# Altium schematic sheet deepshark_power_switch.SchDoc
size A4
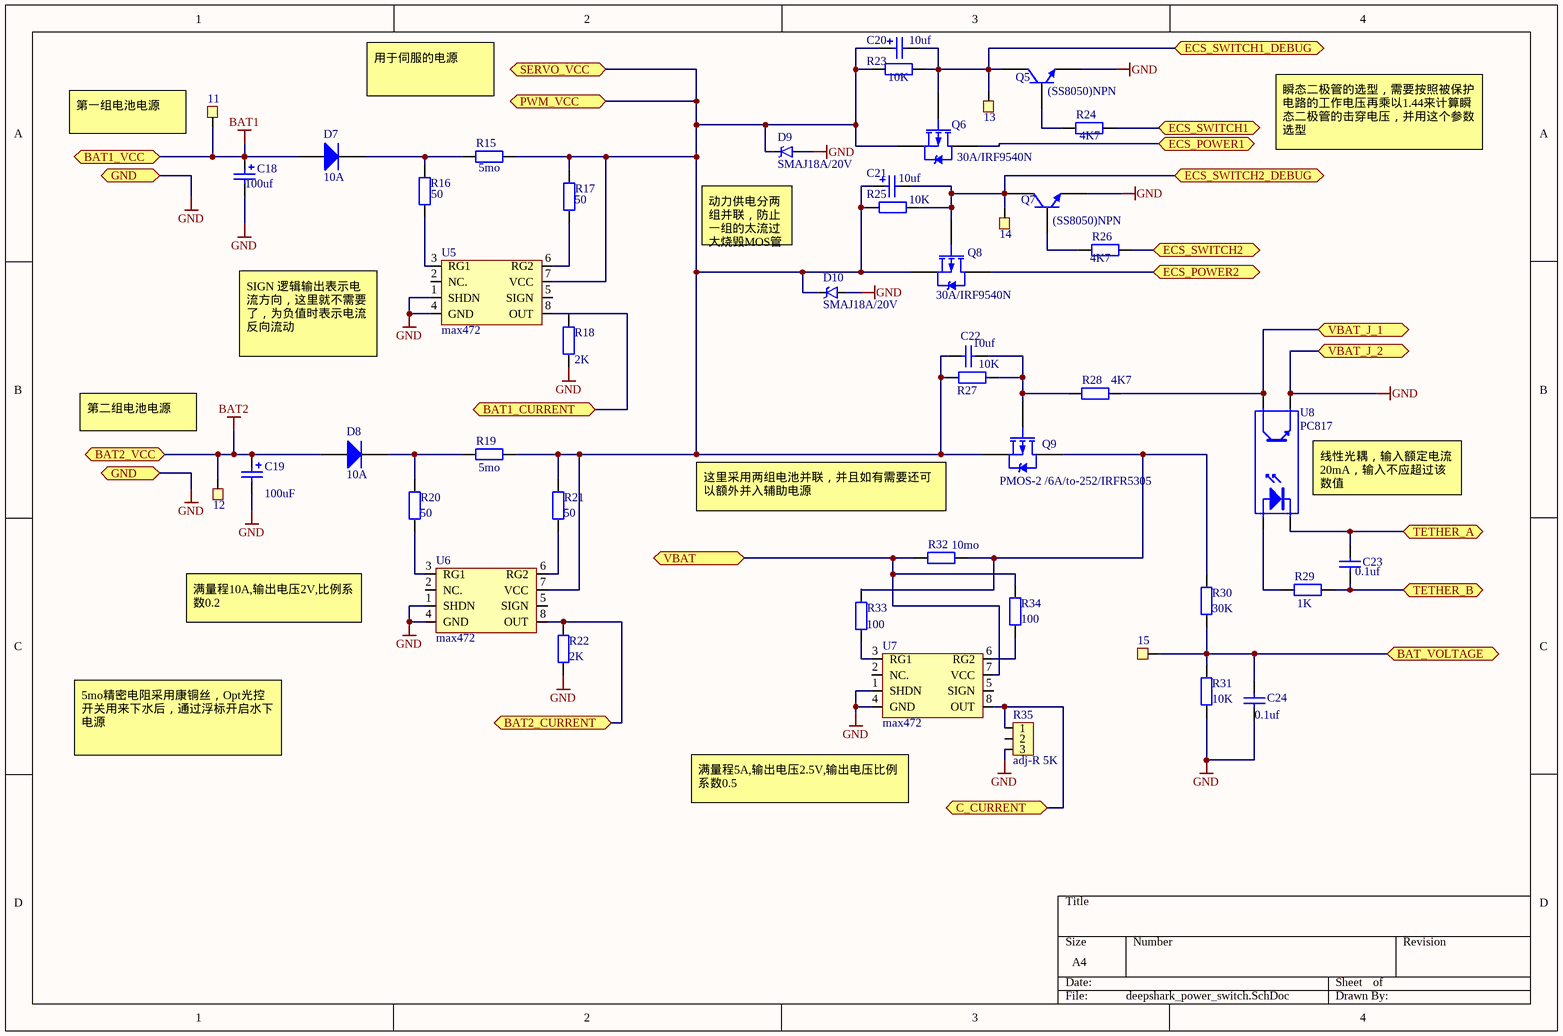
[diagram p0: deepshark_power_switch.SchDoc]

## Parts
11  TP  [TestPoint]  (value not drawn)
12  TP  [TestPoint]  (value not drawn)
13  TP  [TestPoint]  (value not drawn)
14  TP  [TestPoint]  (value not drawn)
15  TP  [TestPoint]  (value not drawn)
C18  value 100uf  [100uf-25v]  (hidden comment: Cap Pol2)
C19  value 100uF  [100uf-25v]  (hidden comment: Cap Pol2)
C20  value 10uf  [1206]  (hidden comment: Cap Pol2)
C21  value 10uf  [1206]  (hidden comment: Cap Pol2)
C22  value 10uf  [1206]  (hidden comment: Cap)
C23  value 0.1uf  [6-0805_M]  (hidden comment: Cap)
C24  value 0.1uf  [6-0805_M]  (hidden comment: Cap)
D7  10A  [10A-Rectifier]
D8  10A  [10A-Rectifier]
D9  SMAJ18A/20V  [SMBJ6.5A]
D10  SMAJ18A/20V  [SMBJ6.5A]
Q5  (SS8050)NPN  [SOT89M]
Q6  30A/IRF9540N  [my-TO-220AB]
Q7  (SS8050)NPN  [SOT89M]
Q8  30A/IRF9540N  [my-TO-220AB]
Q9  PMOS-2 /6A/to-252/IRFR5305  [TO-252AA]
R15  value 5mo  [5mo]  (hidden comment: Res2)
R16  value 50  [my0603]  (hidden comment: Res2)
R17  value 50  [my0603]  (hidden comment: Res2)
R18  value 2K  [6-0805_M]  (hidden comment: Res2)
R19  value 5mo  [5mo]  (hidden comment: Res2)
R20  value 50  [my0603]  (hidden comment: Res2)
R21  value 50  [my0603]  (hidden comment: Res2)
R22  value 2K  [6-0805_M]  (hidden comment: Res2)
R23  value 10K  [6-0805_M]  (hidden comment: Res2)
R24  value 4K7  [6-0805_M]  (hidden comment: Res2)
R25  value 10K  [6-0805_M]  (hidden comment: Res2)
R26  value 4K7  [6-0805_M]  (hidden comment: Res2)
R27  value 10K  [6-0805_M]  (hidden comment: Res2)
R28  value 4K7  [6-0805_M]  (hidden comment: Res2)
R29  value 1K  [6-0805_M]  (hidden comment: Res2)
R30  value 30K  [6-0805_M]  (hidden comment: Res2)
R31  value 10K  [6-0805_M]  (hidden comment: Res2)
R32  value 10mo  [10mo]  (hidden comment: Res2)
R33  value 100  [my0603]  (hidden comment: Res2)
R34  value 100  [my0603]  (hidden comment: Res2)
R35  adj-R 5K  [adj-R]
U5  max472  [SO-8_M]
U6  max472  [SO-8_M]
U7  max472  [SO-8_M]
U8  PC817  [DIP-4]

## Ports
BAT1_CURRENT, BAT1_VCC, BAT2_CURRENT, BAT2_VCC, BAT_VOLTAGE, C_CURRENT, ECS_POWER1, ECS_POWER2, ECS_SWITCH1, ECS_SWITCH1_DEBUG, ECS_SWITCH2, ECS_SWITCH2_DEBUG, GND, PWM_VCC, SERVO_VCC, TETHER_A (bidir), TETHER_B (bidir), VBAT, VBAT_J_1, VBAT_J_2

## Nets
BAT1: 11.1 C18.1 D7.1(A) ; port BAT1_VCC
BAT2: 12.1 C19.1 D8.1(A) ; port BAT2_VCC
GND: C18.2 C19.2 C24.1 D9.A D10.A Q5.3(E) Q7.3(E) R18.1 R22.1 R31.1 R35.3 U5.1(SHDN) U5.4(GND) U6.1(SHDN) U6.4(GND) U7.1(SHDN) U7.4(GND) U8.3(E) ; port GND, port VBAT_J_2
BAT1_CURRENT: R18.2 U5.8(OUT) ; port BAT1_CURRENT
BAT2_CURRENT: R22.2 U6.8(OUT) ; port BAT2_CURRENT
BAT_VOLTAGE: 15.1 C24.2 R30.1 R31.2 ; port BAT_VOLTAGE
C_CURRENT: R35.1 U7.8(OUT) ; port C_CURRENT
ECS_POWER1: Q6.2(D) ; port ECS_POWER1
ECS_POWER2: Q8.2(D) ; port ECS_POWER2
ECS_SWITCH1: R24.1 ; port ECS_SWITCH1
ECS_SWITCH1_DEBUG: 13.1 C20.2 Q5.1(C) Q6.1(G) R23.2 ; port ECS_SWITCH1_DEBUG
ECS_SWITCH2: R26.2 ; port ECS_SWITCH2
ECS_SWITCH2_DEBUG: 14.1 C21.2 Q7.1(C) Q8.1(G) R25.2 ; port ECS_SWITCH2_DEBUG
PWM_VCC: C20.1 C21.1 C22.1 D9.K D10.K Q6.3(S) Q8.3(S) Q9.3(S) R15.2 R17.2 R19.2 R21.2 R23.1 R25.1 R27.1 U5.7(VCC) U6.7(VCC) ; port SERVO_VCC, port PWM_VCC
TETHER_A: C23.2 U8.2(K) ; port TETHER_A
TETHER_B: C23.1 R29.2 ; port TETHER_B
VBAT: R32.1 R34.2 U7.7(VCC) ; port VBAT
VBAT_J_1: R28.2 U8.4(C) ; port VBAT_J_1
NetC22_2: C22.2 Q9.1(G) R27.2 R28.1
NetD7_2: D7.2(K) R15.1 R16.2
NetD8_2: D8.2(K) R19.1 R20.2
NetQ5_2: Q5.2(B) R24.2
NetQ7_2: Q7.2(B) R26.1
NetQ9_4: Q9.4(D) R30.2 R32.2 R33.2
NetR16_1: R16.1 U5.3(RG1)
NetR17_1: R17.1 U5.6(RG2)
NetR20_1: R20.1 U6.3(RG1)
NetR21_1: R21.1 U6.6(RG2)
NetR29_1: R29.1 U8.1(A)
NetR33_1: R33.1 U7.3(RG1)
NetR34_1: R34.1 U7.6(RG2)

Not connected (* = marked no-connect by the designer): R35 2; U5 2(NC.) 5(SIGN); U6 2(NC.) 5(SIGN); U7 2(NC.) 5(SIGN)

## Notes on the sheet
- 用于伺服的电源
- (near 11) 第一组电池电源
- 瞬态二极管的选型，需要按照被保护电路的工作电压再乘以1.44来计算瞬态二极管的击穿电压，并用这个参数选型
- (near D9) 动力供电分两组并联，防止一组的太流过大烧毁MOS管
- SIGN 逻辑输出表示电流方向，这里就不需要了，为负值时表示电流反向流动
- 第二组电池电源
- 这里采用两组电池并联，并且如有需要还可以额外并入辅助电源
- (near U8) 线性光耦，输入额定电流20mA，输入不应超过该数值
- 满量程10A,输出电压2V,比例系数0.2
- 5mo精密电阻采用康铜丝，Opt光控开关用来下水后，通过浮标开启水下电源
- (near U7) 满量程5A,输出电压2.5V,输出电压比例系数0.5

## Library data of the parts
C18-C21 = Cap Pol2: Polarized Capacitor (Axial); Published: 8-Jun-2000; LatestRevisionDate: 17-Jul-2002; LatestRevisionNote: Re-released for DXP Platform.; PackageReference: POLAR0.8; Publisher: Altium Limited; PackageDescription: Polarized Capacitor; 2 Leads
C22-C24 = Cap: Capacitor; Published: 8-Jun-2000; LatestRevisionDate: 17-Jul-2002; LatestRevisionNote: Re-released for DXP Platform.; PackageReference: RAD-0.3; Publisher: Altium Limited; PackageDescription: Radial Cap, Thru-Hole; 2 Leads; 0.3 in Pin Spacing
D7 D8 = Diode: Default Diode; Published: 8-Jun-2000; LatestRevisionDate: 17-Jul-2002; LatestRevisionNote: Re-released for DXP Platform.; PackageVersion: Sep-1996; PackageReference: SMC; Publisher: Altium Limited; PackageDescription: DO-214-AB/SMC; 2 C-Bend Leads; Body 7.9 x 5.9 mm, inc. leads (LxW); Code_JEDEC: DO-214-AB
D9 D10 = DW
Q5 Q7 = NPN: NPN Bipolar Transistor; pin to pad: 1>2 2>1; Published: 8-Jun-2000; LatestRevisionDate: 17-Jul-2002; LatestRevisionNote: Re-released for DXP Platform.; PackageReference: TO-226-AA; Publisher: Altium Limited; PackageDescription: TO, Flat Index; 3 In-Line, Axial Leads; Body Dia. 4.8mm; Leads 0.55 x 0.51 mm (max); Code_JEDEC: TO-226-AA
Q6 Q8 Q9 = PMOS-2: P-Channel Power MOSFET; Note: Pin 4 not drawn and electrically connected to Pin 2.; Published: 8-Jun-2000; LatestRevisionDate: 17-Jul-2002; LatestRevisionNote: Re-released for DXP Platform.; DatasheetVersion: PD-9.390D; PackageVersion: Feb-1997; PackageReference: TO-220AB; Publisher: Altium Limited; PackageDescription: TO, Thru-Hole, Vertical, Heatsink Mounted; 3 In-Line Leads; Pitch 2.54 mm; ComponentLink1Description: Manufacturer Link; ComponentLink1URL: http://www.irf.com/
R15-R34 = Res2: Resistor; Published: 8-Jun-2000; LatestRevisionDate: 17-Jul-2002; LatestRevisionNote: Re-released for DXP Platform.; PackageReference: AXIAL-0.4; Publisher: Altium Limited; PackageDescription: Axial Device, Thru-Hole; 2 Leads; 0.4 in Pin Spacing
R35 = adj-R
U8 = Optoisolator1: 4-Pin Phototransistor Optocoupler; Published: 24-Mar-1999; LatestRevisionDate: 04-Mar-2005; LatestRevisionNote: Sch pins 3 & 4 Swapped.; DatasheetVersion: Nov-2003; PackageReference: DIP-4; Publisher: Altium Limited